# EAGLE design AstroEQ PTH MK2 (EAGLE 6.4)
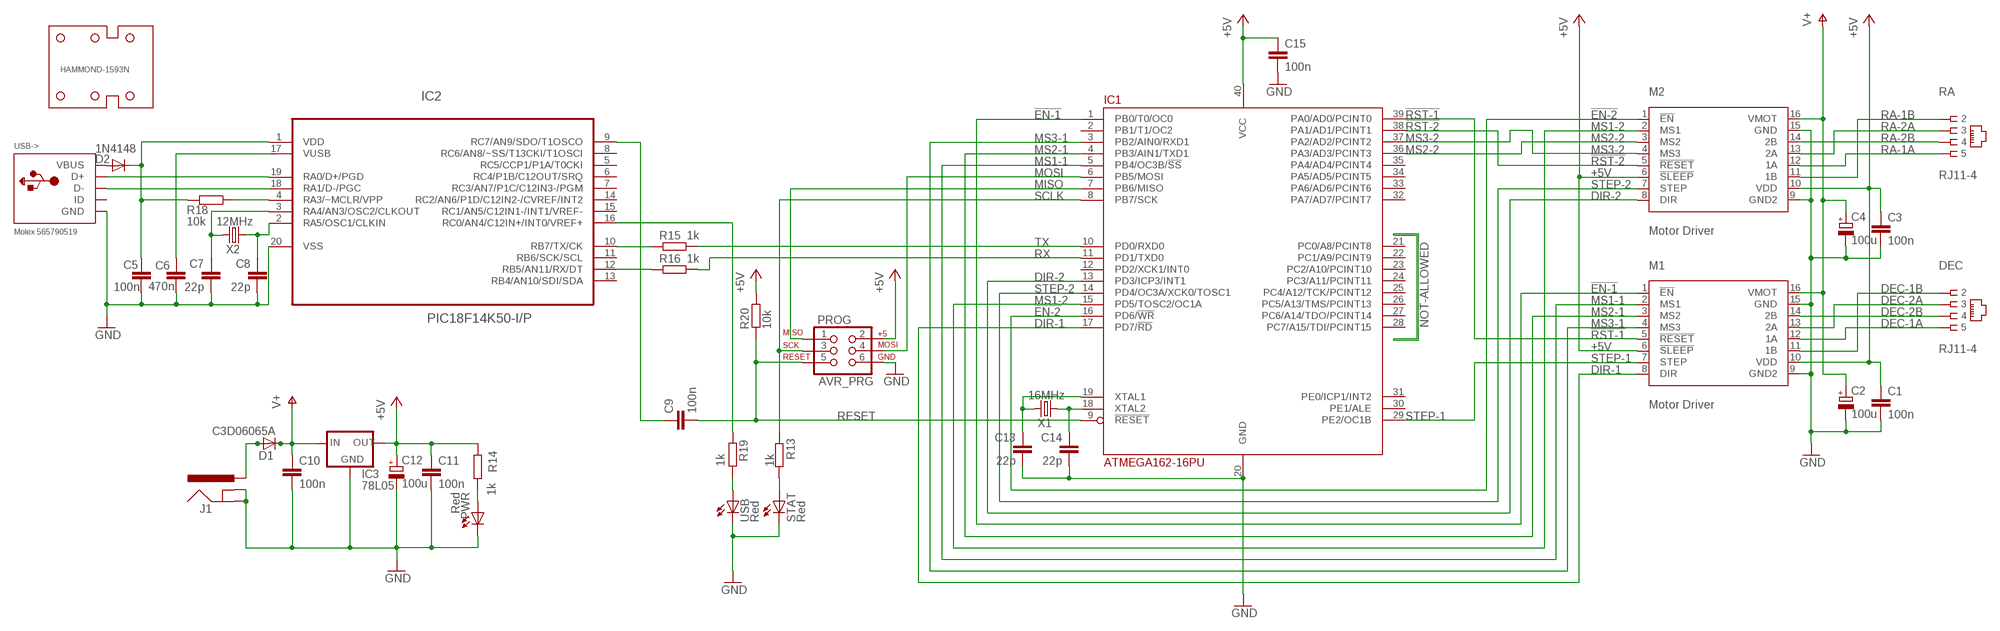
[diagram p0: schematic, sheet 1]

## Parts
C1  100n  C-EU025-024X044  [C025-024X044]
C2  100u  CPOL-EUE2.5-7  [E2,5-7]
C3  100n  C-EU025-024X044  [C025-024X044]
C4  100u  CPOL-EUE2.5-7  [E2,5-7]
C5  100n  C-EU025-024X044  [C025-024X044]
C6  470n  C-EU025-024X044  [C025-024X044]
C7  22p  C-EU025-024X044  [C025-024X044]
C8  22p  C-EU025-024X044  [C025-024X044]
C9  100n  C-EU025-024X044  [C025-024X044]
C10  100n  C-EU025-024X044  [C025-024X044]
C11  100n  C-EU025-024X044  [C025-024X044]
C12  100u  CPOL-EUE2.5-7  [E2,5-7]
C13  22p  C-EU025-024X044  [C025-024X044]
C14  22p  C-EU025-024X044  [C025-024X044]
C15  100n  C-EU025-024X044  [C025-024X044]
D1  C3D06065A  MUR820  [C221B1A]
D2  1N4148  DIODE1N4148  [DIODE-1N4148]
DEC  RJ11-4  [RJ11-NO_SHIELD-4]
HAMMOND-1593N  HAMMOND-1593N  [HAMMOND-1593N]
IC1  ATMEGA162-16PU  [DIL40]
IC2  PIC18F14K50-I/P  [DIL20]
IC3  78L05  V_REG_78XXTO-92  [TO-92]
J1  POWER_JACKPTH  [POWER_JACK_PTH]
M1  Motor Driver  A4983CARRIER  [DIP16-W]
M2  Motor Driver  A4983CARRIER  [DIP16-W]
PROG  AVR_PRG  AVR_SPI_PRG_6PTH  [2X3]
PWR  Red  LED3MM  [LED3MM]
R13  1k  R-EU_0204/7  [0204/7]
R14  1k  R-EU_0204/7  [0204/7]
R15  1k  R-EU_0204/7  [0204/7]
R16  1k  R-EU_0204/7  [0204/7]
R18  10k  R-EU_0204/7  [0204/7]
R19  1k  R-EU_0204/7  [0204/7]
R20  10k  R-EU_0204/7  [0204/7]
RA  RJ11-4  [RJ11-NO_SHIELD-4]
STAT  Red  LED3MM  [LED3MM]
USB  Red  LED3MM  [LED3MM]
USB->  Molex 565790519  USBMOLEX  [USB-MINIB-THM-MOLEX]
X1  16MHz  CRYSTALHC49US  [HC49US]
X2  12MHz  CRYSTALHC49US  [HC49US]

## Nets
!EN-1: IC1.1(PB0/T0/OC0) M1.1(!EN)
!EN-2: IC1.16(PD6/!WR) M2.1(!EN)
!RST-1: IC1.39(PA0/AD0/PCINT0) M1.5(!RESET)
!RST-2: IC1.38(PA1/AD1/PCINT1) M2.5(!RESET)
+5V: C1.1 C3.1 C11.1 C12.+ C15.1 IC1.40(VCC) IC3.1(OUT) M1.6(!SLEEP) M1.10(VDD) M2.6(!SLEEP) M2.10(VDD) PROG.2 R14.1 R20.2
AVROSC1: C13.1 IC1.19(XTAL1) X1.2
AVROSC2: C14.1 IC1.18(XTAL2) X1.1
D+: IC2.19(RA0/D+/PGD) USB->.D+
D-: IC2.18(RA1/D-/PGC) USB->.D-
DEC-1A: DEC.5 M1.12(1A)
DEC-1B: DEC.2 M1.11(1B)
DEC-2A: DEC.3 M1.13(2A)
DEC-2B: DEC.4 M1.14(2B)
DIR-1: IC1.17(PD7/!RD) M1.8(DIR)
DIR-2: IC1.13(PD3/ICP3/INT1) M2.8(DIR)
DTR: C9.1 IC2.9(RC7/AN9/SDO/T1OSCO)
GND: C1.2 C2.- C3.2 C4.- C5.2 C6.1 C7.2 C8.2 C10.2 C11.2 C12.- C13.2 C14.2 C15.2 IC1.20(GND) IC2.20(VSS) IC3.2(GND) J1.GND J1.GNDBREAK M1.9(GND2) M1.15(GND) M2.9(GND2) M2.15(GND) PROG.6 PWR.K(C) STAT.K(C) USB->.GND USB->.GND1(GND) USB->.GND4(GND) USB.K(C)
MCLR: IC2.4(RA3/~MCLR/VPP) R18.1
MISO: IC1.7(PB6/MISO) PROG.1
MOSI: IC1.6(PB5/MOSI) PROG.4
MS1-1: IC1.5(PB4/OC3B/!SS) M1.2(MS1)
MS1-2: IC1.15(PD5/TOSC2/OC1A) M2.2(MS1)
MS2-1: IC1.4(PB3/AIN1/TXD1) M1.3(MS2)
MS2-2: IC1.36(PA3/AD3/PCINT3) M2.3(MS2)
MS3-1: IC1.3(PB2/AIN0/RXD1) M1.4(MS3)
MS3-2: IC1.37(PA2/AD2/PCINT2) M2.4(MS3)
PWRLED: PWR.A R14.2
RA-1A: M2.12(1A) RA.5
RA-1B: M2.11(1B) RA.2
RA-2A: M2.13(2A) RA.3
RA-2B: M2.14(2B) RA.4
RESET: C9.2 IC1.9(!RESET) PROG.5 R20.1
RX: IC1.11(PD1/TXD0) R16.1
RX(USB): IC2.12(RB5/AN11/RX/DT) R16.2
SCLK: IC1.8(PB7/SCK) PROG.3 R13.1
STATLED: R13.2 STAT.A
STEP-1: IC1.29(PE2/OC1B) M1.7(STEP)
STEP-2: IC1.14(PD4/OC3A/XCK0/TOSC1) M2.7(STEP)
TX: IC1.10(PD0/RXD0) R15.1
TX(USB): IC2.10(RB7/TX/CK) R15.2
USBLED: R19.1 USB.A
USBOSC1: C8.1 IC2.2(RA5/OSC1/CLKIN) X2.1
USBOSC2: C7.1 IC2.3(RA4/AN3/OSC2/CLKOUT) X2.2
USBSTAT: IC2.16(RC0/AN4/C12IN+/INT0/VREF+) R19.2
V+: C2.+ C4.+ C10.1 D1.C IC3.3(IN) M1.16(VMOT) M2.16(VMOT)
VBUS: D2.A USB->.VBUS
VIN: D1.A J1.PWR
VPIC: C5.1 D2.C IC2.1(VDD) R18.2
VUSB: C6.2 IC2.17(VUSB)
Unconnected: IC1.2(PB1/T1/OC2) IC1.12(PD2/XCK1/INT0) IC1.21(PC0/A8/PCINT8) IC1.22(PC1/A9/PCINT9) IC1.23(PC2/A10/PCINT10) IC1.24(PC3/A11/PCINT11) IC1.25(PC4/A12/TCK/PCINT12) IC1.26(PC5/A13/TMS/PCINT13) IC1.27(PC6/A14/TDO/PCINT14) IC1.28(PC7/A15/TDI/PCINT15) IC1.30(PE1/ALE) IC1.31(PE0/ICP1/INT2) IC1.32(PA7/AD7/PCINT7) IC1.33(PA6/AD6/PCINT6) IC1.34(PA5/AD5/PCINT5) IC1.35(PA4/AD4/PCINT4) IC2.5(RC5/CCP1/P1A/T0CKI) IC2.6(RC4/P1B/C12OUT/SRQ) IC2.7(RC3/AN7/P1C/C12IN3-/PGM) IC2.8(RC6/AN8/~SS/T13CKI/T1OSCI) IC2.11(RB6/SCK/SCL) IC2.13(RB4/AN10/SDI/SDA) IC2.14(RC2/AN6/P1D/C12IN2-/CVREF/INT2) IC2.15(RC1/AN5/C12IN1-/INT1/VREF-) USB->.ID

## Library data of the parts
C1 C3 C5 C9-C11 C15 = resistor:C-EU: CAPACITOR, European symbol; MF: AVX; MPN: SR205C104KAR; OC_FARNELL: 1100367
C2 C4 C12 = resistor:CPOL-EU: POLARIZED CAPACITOR, European symbol; MF: MULTICOMP; MPN: MCGPR25V107M6.3X11; OC_FARNELL: 9451188
C6 = rcl:C-EU: CAPACITOR, European symbol; MF: KEMET; MPN: C320C474M5U5TA; OC_FARNELL: 1457660
C7 C8 C13 C14 = rcl:C-EU: CAPACITOR, European symbol; MF: AVX; MPN: SR151A220JAR; OC_FARNELL: 1100369
D1 = diode:MUR820: DIODE; MF: CREE; MPN: C3D06065A; OC_FARNELL: 1864928
D2 = SparkFun:DIODE: Diode These are standard reverse protection diodes and small signal diodes. SMA package can handle up to about 1A. SOD-323 can handle about 200mA. What the SOD-323 package when ordering, there are some mfgs out there that are 5-pin packages.; MF: MULTICOMP; MPN: 1N4148.; OC_FARNELL: 9565124
DEC RA = con-tycoelectronics:RJ11-4; MF: MOLEX; MPN: 95501-2641; OC_FARNELL: 1560166
HAMMOND-1593N = holes:HAMMOND-1593N; MF: HAMMOND; MPN: 1593NBK; OC_FARNELL: 9287566
IC1 = atmel:ATMEGA162: 8-bit RISC MICROCONTROLLER 16K Bytes internal flash program memory 1K Bytes internal SRAM Upto 64K Bytes optional external memory space 512 Bytes EEPROM Two 8-bit timers Two 16-bit timers Dual programmable serial USARTs Master/Slave serial SPI interface Source: ATMEGA162_DIP40.lbr; MF: ATMEL; MPN: ATMEGA162-16PU; OC_FARNELL: 9171169
IC2 = microchip:PIC18F14K50-I/P: USB Flash Microcontrollers; MF: MICROCHIP; MPN: PIC18F14K50-I/P; OC_FARNELL: 1648501; OC_NEWARK: 77M3103; PACKAGE: DIP-20; SUPPLIER: Microchip
IC3 = SparkFun:V_REG_78XX: Voltage Regulator Standard 7805 5V regulator. IGO (Input Ground Output). Spark Fun Electronics SKU : COM-00107; MF: FAIRCHILD SEMICONDUCTOR; MPN: LM78L05ACZX; OC_FARNELL: 1467367
J1 = SparkFun:POWER_JACK: Power Jack This is the standard 5.5mm barrel jack for power. The PTH is the most common, proven, reliable, footprint. All others are experimental. The Slot footprint only works if the mill layer is transmitted to the PCB fab house so be warned. Spark Fun Electronics SKU : PRT-00119. Mating wall wart : TOL-00298 (and others); MF: MULTICOMP; MPN: MJ-179PH; OC_FARNELL: 1737246
M1 M2 = A4983Carrier:A4983CARRIER; MF: SAMTEC; MPN: CES-116-01-T-S; OC_FARNELL: 1667522
PROG = SparkFun:AVR_SPI_PRG_6: AVR ISP 6 Pin This is the reduced ISP connector for AVR programming. Common on Arduino. This footprint will take up less PCB space and can be used with a 10-pin to 6-pin adapter such as SKU: BOB-08508; MF: TE CONNECTIVITY / AMP; MPN: 826632-3; OC_FARNELL: 3418492
PWR STAT USB = led:LED: LED OSRAM: - CHIPLED LG R971, LG N971, LY N971, LG Q971, LY Q971, LO R971, LY R971 LH N974, LH R974 LS Q976, LO Q976, LY Q976 LO Q996 - Hyper CHIPLED LW Q18S LB Q993, LB Q99A, LB R99A - SideLED LS A670, LO A670, LY A670, LG A670, LP A670 LB A673, LV A673, LT A673, LW A673 LH A674 LY A675 LS A676, LA A676, LO A676, LY A676, LW A676 LS A679, LY A679, LG A679 - Hyper Micro SIDELED® LS Y876, LA Y876, LO Y876, LY Y876 LT Y87S - SmartLED LW L88C, LW L88S LB L89C, LB L89S, LG L890 LS L89K, LO L89K, LY L89K LS L896, LA L896, LO L896, LY L896 - TOPLED LS T670, LO T670, LY T670, LG T670, LP T670 LSG T670, LSP T670, LSY T670, LOP T670, LYG T670 LG T671, LOG T671, LSG T671 LB T673, LV T673, LT T673, LW T673 LH T674 LS T676, LA T676, LO T676, LY T676, LB T676, LH T676, LSB T676, LW T676 LB T67C, LV T67C, LT T67C, LS T67K, LO T67K, LY T67K, LW E67C LS E67B, LA E67B, LO E67B, LY E67B, LB E67C, LV E67C, LT E67C LW T67C LS T679, LY T679, LG T679 LS T770, LO T770, LY T770, LG T770, LP T770 LB T773, LV T773, LT T773, LW T773 LH T774 LS E675, LA E675, LY E675, LS T675 LS T776, LA T776, LO T776, LY T776, LB T776 LHGB T686 LT T68C, LB T68C - Hyper Mini TOPLED® LB M676 - Mini TOPLED Santana® LG M470 LS M47K, LO M47K, LY M47K Source: http://www.osram.convergy.de LUXEON: - LUMILED® LXK2-PW12-R00, LXK2-PW12-S00, LXK2-PW14-U00, LXK2-PW14-V00 LXK2-PM12-R00, LXK2-PM12-S00, LXK2-PM14-U00 LXK2-PE12-Q00, LXK2-PE12-R00, LXK2-PE12-S00, LXK2-PE14-T00, LXK2-PE14-U00 LXK2-PB12-K00, LXK2-PB12-L00, LXK2-PB12-M00, LXK2-PB14-N00, LXK2-PB14-P00, LXK2-PB14-Q00 LXK2-PR12-L00, LXK2-PR12-M00, LXK2-PR14-Q00, LXK2-PR14-R00 LXK2-PD12-Q00, LXK2-PD12-R00, LXK2-PD12-S00 LXK2-PH12-R00, LXK2-PH12-S00 LXK2-PL12-P00, LXK2-PL12-Q00, LXK2-PL12-R00 Source: www.luxeon.com KINGBRIGHT: KA-3528ASYC Source: www.kingbright.com; MF: KINGBRIGHT; MPN: L-424HDT; OC_FARNELL: 1142499
R13 R14 R19 = rcl:R-EU_: RESISTOR, European symbol; MF: MULTICOMP; MPN: MF12 1K; OC_FARNELL: 9342400
R15 R16 = SmartPrj:R-EU_: RESISTOR, European symbol; MF: MULTICOMP; MPN: MF12 1K; OC_FARNELL: 9342400
R18 R20 = rcl:R-EU_: RESISTOR, European symbol; MF: MULTICOMP; MPN: MF12 10K; OC_FARNELL: 9342419
USB-> = adafruit:USB: USB Connectors USBMINIB - Surface Mount Female Mini-B USB Connector 4UConnector: 06564 By microbuilder.eu Thru-hole RA Female Mini-B USB Connector 4UConnector: 18732 By ladyada.net; MF: MOLEX; MPN: 565790519; OC_FARNELL: 1125347
X1 = SparkFun:CRYSTAL: Crystals Various standard crystals. Proven footprints. Spark Fun Electronics SKU : COM-00534; MF: TXC; MPN: 9B-16.000MEEJ-B; OC_FARNELL: 1842217
X2 = SparkFun:CRYSTAL: Crystals Various standard crystals. Proven footprints. Spark Fun Electronics SKU : COM-00534; MF: TXC; MPN: 9B-12.000MAAJ-B; OC_FARNELL: 1842203

## Net classes
1 power: width 0.61 mm, drill 0.711 mm, clearance 0.203 mm
2 gnd: width 0.305 mm, drill 0.711 mm, clearance 0.203 mm
3 usbvcc: width 0.508 mm, drill 0.711 mm, clearance 0.203 mm

## Board
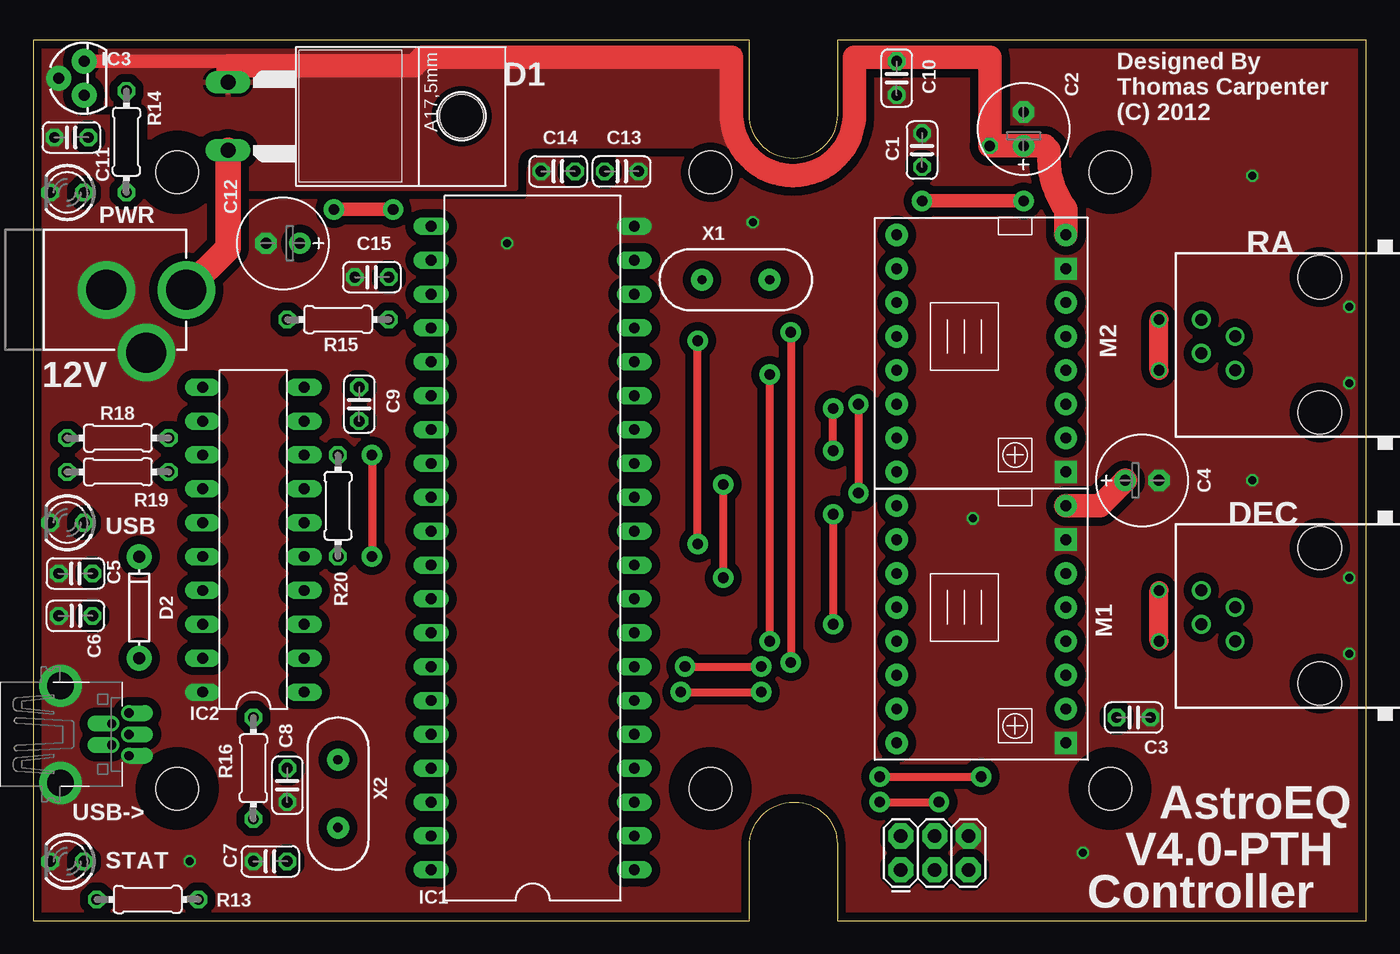
[diagram p1: board, top side]
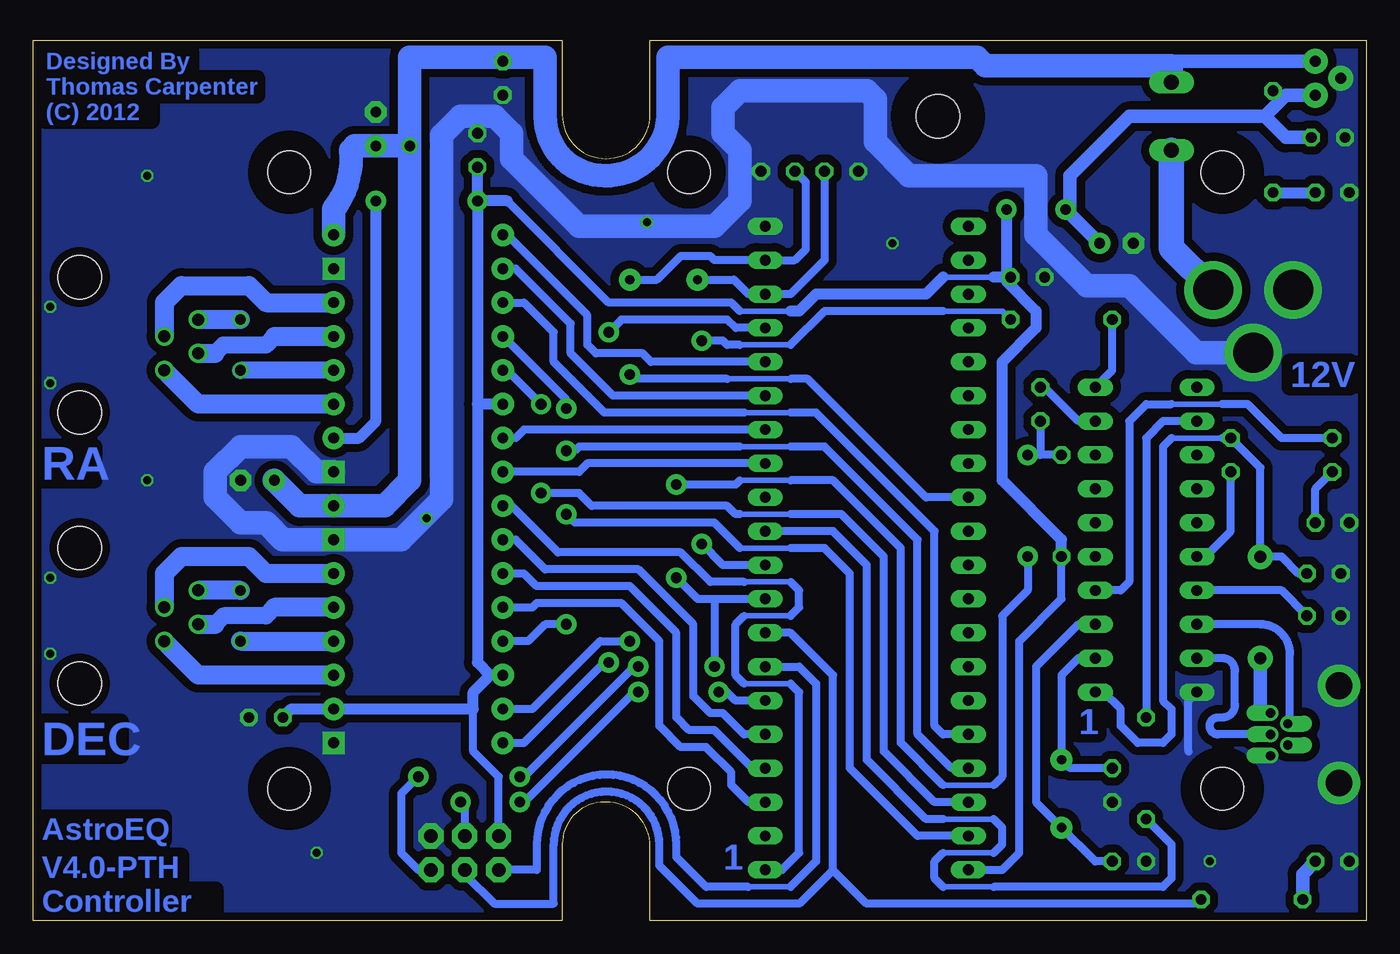
[diagram p2: board, bottom side, seen from below]

Size 100 x 66.04 mm. Coordinates in mm from the lower left corner, seen from the top.
Outline: 57.02,8.89 57.15,8.89
Copper layers (1*16): Top 0.035mm / dielectric 1.5mm / Bottom 0.035mm
Design rules "default": minimum track width 6mil, minimum drill 12mil, track to track 6mil, track to pad 6mil, pad to pad 6mil, via to via 6mil, smd to smd 0mil, copper to edge 10mil, drill to drill 10mil, minimum pad ring 10mil, minimum via ring 6mil, stop-mask expansion 2mil, vias tented up to drill 0.8mm, thermal gap 10mil
tKeepout: area 78.3,7.4 to 83.3,12.4; area 78.3,53.6 to 83.3,58.6; area 48.3,7.4 to 53.3,12.4; area 8.3,7.4 to 13.3,12.4; area 48.3,53.6 to 53.3,58.6; area 8.3,53.6 to 13.3,58.6
bKeepout: area 78.3,7.4 to 83.3,12.4; area 78.3,53.6 to 83.3,58.6; area 48.3,7.4 to 53.3,12.4; area 8.3,7.4 to 13.3,12.4; area 48.3,53.6 to 53.3,58.6; area 8.3,53.6 to 13.3,58.6
tRestrict: area 78.3,53.6 to 83.3,58.6; area 78.3,7.4 to 83.3,12.4; area 48.3,7.4 to 53.3,12.4; area 8.3,7.4 to 13.3,12.4; area 8.3,53.6 to 13.3,58.6; area 6.3,56.2 to 7.9,60.6
bRestrict: area 78.3,53.6 to 83.3,58.6; area 78.3,7.4 to 83.3,12.4; area 8.3,7.4 to 13.3,12.4; area 8.3,53.6 to 13.3,58.6; 2 lines

### Footprints (pad centres in the part's own frame; a part is rotated, then mirrored left to right if it is on the bottom)
C025-024X044 = drill 0.813 octagon: 1 -1.27,0; 2 1.27,0
E2,5-7 = drill 0.813 pad 1.6: + -1.27,0 | drill 0.813 pad 1.6 octagon: - 1.27,0
C221B1A = drill 1.118 long: A 2.54,-6.35; C -2.54,-6.35 | hole 3.302: 0,11.176
DIODE-1N4148 = drill 0.9 pad 1.88: A -3.81,0; C 3.81,0
RJ11-NO_SHIELD-4 = drill 0.9 pad 1.4: 2 -1.905,6.35; 3 -0.635,8.89; 4 0.635,6.35; 5 1.905,8.89 | hole 3.251: -5.08,0; 5.08,0
HAMMOND-1593N = hole 3.2: 10.795,9.906; 10.795,56.134; 50.8,9.906; 50.8,56.134; 80.797,9.906; 80.797,56.134
DIL40 = drill 0.813 long: 1 -24.13,-7.62; 2 -21.59,-7.62; 3 -19.05,-7.62; 4 -16.51,-7.62; 5 -13.97,-7.62; 6 -11.43,-7.62; 7 -8.89,-7.62; 8 -6.35,-7.62; 9 -3.81,-7.62; 10 -1.27,-7.62; 11 1.27,-7.62; 12 3.81,-7.62; 13 6.35,-7.62; 14 8.89,-7.62; 15 11.43,-7.62; 16 13.97,-7.62; 17 16.51,-7.62; 18 19.05,-7.62; 19 21.59,-7.62; 20 24.13,-7.62; 21 24.13,7.62; 22 21.59,7.62; 23 19.05,7.62; 24 16.51,7.62; 25 13.97,7.62; 26 11.43,7.62; 27 8.89,7.62; 28 6.35,7.62; 29 3.81,7.62; 30 1.27,7.62; 31 -1.27,7.62; 32 -3.81,7.62; 33 -6.35,7.62; 34 -8.89,7.62; 35 -11.43,7.62; 36 -13.97,7.62; 37 -16.51,7.62; 38 -19.05,7.62; 39 -21.59,7.62; 40 -24.13,7.62
DIL20 = drill 0.813 long: 1 -3.81,11.43; 2 -3.81,8.89; 3 -3.81,6.35; 4 -3.81,3.81; 5 -3.81,1.27; 6 -3.81,-1.27; 7 -3.81,-3.81; 8 -3.81,-6.35; 9 -3.81,-8.89; 10 -3.81,-11.43; 11 3.81,-11.43; 12 3.81,-8.89; 13 3.81,-6.35; 14 3.81,-3.81; 15 3.81,-1.27; 16 3.81,1.27; 17 3.81,3.81; 18 3.81,6.35; 19 3.81,8.89; 20 3.81,11.43
TO-92 = drill 0.813 pad 1.88: 1 -1.27,0; 2 0,1.905; 3 1.27,0
POWER_JACK_PTH = drill 2.997 pad 4.318: GND 0,7.7; GNDBREAK 4.7,10.7; PWR 0,13.7
DIP16-W = drill 0.813 pad 1.676: 1 -8.89,-6.35; 2 -6.35,-6.35; 3 -3.81,-6.35; 4 -1.27,-6.35; 5 1.27,-6.35; 6 3.81,-6.35; 7 6.35,-6.35; 8 8.89,-6.35; 10 6.35,6.35; 11 3.81,6.35; 12 1.27,6.35; 13 -1.27,6.35; 14 -3.81,6.35; 16 -8.89,6.35 | drill 0.813 pad 1.676 square: 9 8.89,6.35; 15 -6.35,6.35
2X3 = drill 1.016 pad 1.88 octagon: 1 0,0; 2 0,2.54; 3 2.54,0; 4 2.54,2.54; 5 5.08,0; 6 5.08,2.54
LED3MM = drill 0.813 octagon: A -1.27,0; K 1.27,0
0204/7 = drill 0.813 octagon: 1 -3.81,0; 2 3.81,0
USB-MINIB-THM-MOLEX = drill 0.7 offset: D+ 0,9.72; D- -0.8,8.42; GND 1.6,9.72; ID 0.8,8.42; VBUS -1.6,9.72 | drill 2 pad 3.175: GND1 -3.65,4.57; GND4 3.65,4.57
HC49US = drill 0.7 pad 1.651: 1 -2.54,0; 2 2.54,0

### Placement (x,y rotation side)
C1  66.67,57.78 90 top
C2  74.3,59.37 90 top
C3  82.55,15.24 0 top
C4  83.19,33.02 0 top
C5  3.17,26.04 180 top
C6  3.17,22.86 0 top
C7  17.78,4.45 180 top
C8  19.05,10.16 270 top
C9  24.45,38.73 270 top
C10  64.77,63.18 270 top
C11  2.86,58.74 180 top
C12  18.73,50.8 180 top
C13  44.13,56.2 0 top
C14  39.37,56.2 180 top
C15  25.4,48.26 180 top
D1  20.95,60.33 270 top
D2  7.94,23.5 90 top
DEC  96.52,22.86 90 top
HAMMOND-1593N  0,0 0 top
IC1  37.47,27.94 90 top
IC2  16.51,28.57 180 top
IC3  3.81,63.18 90 top
J1  -2.22,47.31 270 top
M1  71.12,22.23 270 top
M2  71.12,42.55 270 top
PROG  65.09,3.81 0 top
PWR  2.54,54.61 180 top
R13  8.57,1.59 180 top
R14  6.99,58.42 270 top
R15  22.86,45.09 180 top
R16  16.51,11.43 90 top
R18  6.35,36.2 0 top
R19  6.35,33.66 0 top
R20  22.86,31.11 270 top
RA  96.52,43.18 90 top
STAT  2.54,4.45 180 top
USB  2.54,29.84 180 top
USB->  -2.54,13.97 270 top
X1  52.7,48.07 0 top
X2  22.86,9.53 270 top

### Tracks (layer width: path | path; a pad name or v marks a point on that pad's centre or on a via)
!EN-1
  Bottom 0.406: 43.18,17.78 46.67,17.78 | 46.67,22.86 43.18,22.86 | 43.18,25.4 46.67,25.4
  Bottom 0.61: IC1.1 43.81,3.81 42.55,5.08 42.55,17.14 43.18,17.78 | 46.67,17.78 47.31,18.41 47.31,22.23 46.67,22.86 | 43.18,22.86 42.55,23.5 42.55,24.77 43.18,25.4 | 46.67,25.4 49.21,25.4 51.44,27.62 60.64,27.62 64.14,31.11 M1.1
!EN-2
  Bottom 0.61: IC1.16 53.66,41.91 54.29,42.55 57.78,42.55 58.42,43.18 58.42,45.4 64.45,51.44 M2.1
!RST-1  (via drill 0.8 pad 1.52)
  Top 0.61: v60.01,30.48 v60.01,22.23
  Bottom 0.406: 43.18,27.94 46.99,27.94
  Bottom 0.61: IC1.39 33.66,6.35 38.73,11.43 38.73,26.04 40.64,27.94 43.18,27.94 | 46.99,27.94 48.9,29.84 59.37,29.84 v60.01,30.48 | v60.01,22.23 61.59,22.23 62.87,20.95 M1.5
!RST-2  (via drill 0.8 pad 1.52)
  Top 0.61: v61.91,38.73 v61.91,32.07
  Bottom 0.406: 43.18,30.48 46.99,30.48
  Bottom 0.61: M2.5 64.45,41.27 v61.91,38.73 | IC1.38 32.38,8.89 36.2,12.7 36.2,27.3 39.37,30.48 43.18,30.48 | 46.99,30.48 47.31,30.48 47.94,31.11 58.1,31.11 59.05,32.07 v61.91,32.07
+5V  (via drill 0.8 pad 1.52)
  Top 1.016: v66.67,53.98 v74.3,53.98 | v22.54,53.34 v26.99,53.34
  Bottom 0.406: 27.94,48.26 31.75,48.26 | 43.18,45.72 46.99,45.72
  Bottom 0.61: IC1.40 27.3,3.81 26.04,5.08 26.04,20.95 22.86,24.13 R20.2 | 46.99,45.72 47.62,46.35 56.83,46.35 64.45,53.98 | PROG.2 65.09,10.79 66.99,12.7 66.99,15.88
  Bottom 0.813: C3.1 80.64,15.88 M1.10 66.99,15.88 66.99,17.14 65.72,18.41 | M2.10 75.56,36.2 74.3,37.47 v74.3,53.98 | M1.6 65.72,18.41 | v66.67,53.98 C1.1 | R20.2 22.86,28.57 27.3,33.02 27.3,41.91 24.77,44.45 24.77,45.72 26.99,47.94 26.99,48.26 | C15.1 26.99,48.26 | 26.99,48.26 27.94,48.26 | 31.75,48.26 33.02,46.99 41.27,46.99 42.55,45.72 43.18,45.72 | 64.45,53.98 v66.67,53.98 | 22.23,53.66 22.23,53.34 v22.54,53.34 | v26.99,53.34 26.99,48.26 | M2.6 66.67,38.73 | v66.67,53.98 66.67,38.73 | 66.67,38.73 66.67,19.37 65.72,18.41
  Bottom 1.016: IC3.1 6.03,61.91 6.35,61.59 | 6.35,61.59 7.62,60.33 | 7.62,60.33 17.78,60.33 22.23,55.88 22.23,53.66 22.23,53.02 C12.+ | R14.1 6.35,61.59 | C11.1 6.03,58.74 7.62,60.33
AVROSC1
  Bottom 0.61: C13.1 42.07,55.4 42.07,50.32 42.86,49.53 IC1.19 48.9,49.53 49.21,49.85 51.44,49.85 53.02,48.26 53.21,48.07 X1.2
AVROSC2
  Bottom 0.61: C14.1 40.64,49.53 43.18,46.99 IC1.18 46.35,46.99 47.31,47.94 47.43,48.07 X1.1
D+
  Bottom 0.61: USB->.D+ 11.11,13.97 arc90 11.75,14.61 arc90 11.11,15.24 10.79,15.24 arc-90 9.84,16.19 9.84,18.73 arc-90 10.79,19.68 IC2.19
D-
  Bottom 0.61: USB->.D- 5.71,14.77 5.71,20 arc-90 7.94,22.23 IC2.18
DEC-1A  (via drill 0.8)
  Top 1.422: v84.45,20.95 v84.45,24.77
  Bottom 1.422: v84.45,24.77 DEC.5 | v84.45,20.95 M1.12
DEC-1B
  Bottom 1.422: M1.11 87.63,18.41 DEC.2
DEC-2A
  Bottom 1.27: 81.92,23.5 82.55,22.86 85.72,22.86 86.36,22.23
  Bottom 1.422: DEC.3 86.36,22.23 | M1.13 81.92,23.5
DEC-2B
  Bottom 1.422: M1.14 82.55,26.04 83.82,27.3 88.9,27.3 90.17,26.04 DEC.4
DIR-1  (via drill 0.8 pad 1.52)
  Top 0.61: v56.83,44.13 v56.83,19.37
  Bottom 0.61: IC1.17 47.31,44.45 47.94,45.09 55.88,45.09 v56.83,44.13 | M1.8 63.18,13.34 57.15,19.37 v56.83,19.37
DIR-2
  Bottom 0.61: IC1.13 58.42,34.29 59.05,33.66 M2.8
DTR
  Bottom 0.61: C9.1 24.13,40.01 21.59,37.47 IC2.9
GND  (via drill 0.6)
  Bottom 0.61: 13.34,12.7 13.34,16.51 IC2.20
  Bottom 1.778: J1.GNDBREAK 12.76,42.61 17.78,47.62 20.95,47.62 24.77,51.44 24.77,55.88 34.29,55.88 36.83,58.42 36.83,61.59 37.47,62.23 46.99,62.23 48.26,60.96 48.26,59.05 46.99,57.78 46.99,53.98 48.9,52.07 59.05,52.07 64.14,57.15 64.14,59.05 65.41,60.33 67.94,60.33 69.37,58.9 69.37,31.59 72.39,28.57 M1.15 81.28,28.57 82.55,29.84 84.45,29.84 86.36,31.75 86.36,33.66 84.45,35.56 80.64,35.56 78.74,33.66 M2.9
  other vias: 35.56,50.8 78.74,5.08 98.74,25.72 98.74,20 98.74,46.04 98.74,40.32 91.44,55.88 91.44,33.02 70.48,30.16 53.98,52.39 11.75,4.45
  pour Top (isolate 0.61, rank 2, no thermals): -1.27,66.99 101.03,66.99 101.03,-0.95 -1.27,-0.95
  pour Bottom (isolate 0.61, no thermals): -1.27,66.99 101.03,66.99 101.03,-0.95 -1.27,-0.95
MCLR
  Bottom 0.406: 10.79,38.73 14.61,38.73
  Bottom 0.61: R18.1 6.35,36.2 8.89,38.73 10.79,38.73 | IC2.4 18.41,24.77 17.78,25.4 17.78,37.47 16.51,38.73 14.61,38.73
MISO
  Bottom 0.406: 43.18,2.54 46.35,2.54
  Bottom 0.61: IC1.7 42.55,19.05 41.27,17.78 41.27,4.45 43.18,2.54 | 46.35,2.54 49.53,2.54 51.75,4.76 51.75,5.71 arc-180 62.23,5.71 62.23,3.81 PROG.1
MOSI  (via drill 0.8 pad 1.52)
  Top 0.61: v48.58,17.14 v54.61,17.14 | v63.5,8.89 v67.94,8.89
  Bottom 0.61: IC1.6 47.31,16.51 47.94,17.14 v48.58,17.14 | v54.61,17.14 54.93,17.14 63.18,8.89 v63.5,8.89 | v67.94,8.89 67.63,8.57 PROG.4
MS1-1
  Bottom 0.61: IC1.5 46.67,13.97 48.26,15.56 49.21,15.56 50.48,16.83 50.48,22.23 54.61,26.35 61.59,26.35 63.82,28.57 M1.2
MS1-2
  Bottom 0.61: IC1.15 56.52,39.37 59.69,42.55 59.69,44.77 63.82,48.9 M2.2
MS2-1
  Bottom 0.61: IC1.4 46.04,11.43 48.9,14.29 50.8,14.29 51.75,15.24 51.75,21.59 55.24,25.08 62.23,25.08 63.18,26.04 M1.3
MS2-2
  Bottom 0.406: 43.18,38.1 46.67,38.1
  Bottom 0.61: M2.3 63.18,46.35 60.96,44.13 60.96,41.91 57.15,38.1 46.67,38.1 | IC1.36 31.75,13.97 32.38,14.61 32.38,29.21 41.27,38.1 43.18,38.1
MS3-1
  Bottom 0.61: IC1.3 46.35,8.89 47.62,10.16 47.62,11.11 49.53,13.02 51.44,13.02 53.02,14.61 53.02,20.95 55.88,23.81 62.23,23.81 62.55,23.5 M1.4
MS3-2  (via drill 0.8 pad 1.52)
  Top 0.61: v60.01,35.24 v60.01,38.42
  Bottom 0.406: 43.18,35.56 46.99,35.56
  Bottom 0.61: IC1.37 31.11,11.43 33.66,13.97 33.66,28.57 40.64,35.56 43.18,35.56 | 46.99,35.56 59.05,35.56 59.37,35.24 v60.01,35.24 | v60.01,38.42 60.01,39.05 M2.4
PWRLED
  Bottom 0.813: R14.2 PWR.A
RA-1A  (via drill 0.8)
  Top 1.422: v84.45,41.27 v84.45,45.09
  Bottom 1.27: M2.12 v84.45,41.27
  Bottom 1.422: v84.45,45.09 RA.5
RA-1B
  Bottom 1.422: M2.11 87.63,38.73 RA.2
RA-2A
  Bottom 1.27: 86.36,42.55 85.72,43.18 82.55,43.18 81.92,43.81
  Bottom 1.422: RA.3 86.36,42.55 | 81.92,43.81 M2.13
RA-2B
  Bottom 1.422: M2.14 82.55,46.35 83.82,47.62 88.9,47.62 90.17,46.35 RA.4
RESET  (via drill 0.8 pad 1.52)
  Top 0.61: v25.4,34.92 v25.4,27.3 | v51.75,32.7 v51.75,25.72 | v48.9,19.05 v54.61,19.05 | v63.5,10.79 v71.12,10.79
  Bottom 0.406: 27.94,10.16 31.75,10.16 | 43.18,33.02 46.99,33.02
  Bottom 0.61: R20.1 24.45,34.92 | C9.2 24.45,34.92 | 24.45,34.92 v25.4,34.92 | v25.4,27.3 25.4,24.77 27.3,22.86 27.3,10.79 27.94,10.16 | 31.75,10.16 34.92,13.34 34.92,27.94 40.01,33.02 43.18,33.02 | 46.99,33.02 47.31,32.7 v51.75,32.7 | v51.75,25.72 50.16,24.13 48.9,24.13 | 48.9,24.13 IC1.9 | 48.9,24.13 v48.9,19.05 | v54.61,19.05 54.93,19.05 63.18,10.79 v63.5,10.79 | v71.12,10.79 72.39,9.53 72.39,5.08 71.12,3.81 PROG.5
RX
  Bottom 0.406: 27.94,2.54 31.75,2.54 | 31.75,5.08 27.94,5.08 | 27.94,7.62 31.75,7.62
  Bottom 0.61: R16.1 14.61,5.71 14.61,3.17 15.24,2.54 27.94,2.54 | 31.75,2.54 32.38,3.17 32.38,4.45 31.75,5.08 | 27.94,5.08 27.3,5.71 27.3,6.99 27.94,7.62 | 31.75,7.62 33.02,7.62 37.47,12.06 37.47,26.67 40.01,29.21 IC1.11
RX(USB)
  Bottom 0.61: IC2.12 15.24,37.47 16.51,36.2 R16.2
SCLK
  Bottom 0.61: R13.1 12.7,1.27 37.49,1.27 40.01,3.79 | 40.01,3.79 40.01,18.41 43.18,21.59 IC1.8 | 40.01,3.79 42.52,1.27 50.16,1.27 53.02,4.13 53.02,5.71 arc-180 60.96,5.71 60.96,1.27 65.41,1.27 67.63,3.49 PROG.3
STATLED
  Bottom 1.016: STAT.A 4.76,3.49 R13.2
STEP-1  (via drill 0.8 pad 1.52)
  Top 0.61: v55.24,40.96 v55.24,20.95
  Bottom 0.406: 43.18,40.64 47.94,40.64
  Bottom 0.61: IC1.29 33.02,31.75 41.91,40.64 43.18,40.64 | 47.94,40.64 54.93,40.64 v55.24,40.96 | M1.7 62.55,15.88 57.47,20.95 v55.24,20.95
STEP-2
  Bottom 0.61: IC1.14 63.18,36.83 63.82,36.2 M2.7
TX  (via drill 0.8 pad 1.52)
  Top 0.61: v49.85,28.26 v49.85,43.5
  Bottom 0.406: R15.1 27.3,45.72 31.75,45.72 | 43.18,43.18 46.99,43.18
  Bottom 0.61: 31.75,45.72 40.64,45.72 43.18,43.18 | 46.99,43.18 47.94,43.18 48.26,43.5 v49.85,43.5 | IC1.10 48.26,26.67 v49.85,28.26
TX(USB)
  Bottom 0.61: IC2.10 19.05,41.27 R15.2
USBLED
  Bottom 0.61: USB.A 3.81,32.38 R19.1
USBOSC1
  Bottom 0.61: IC2.2 21.59,19.68 22.86,18.41 X2.1 22.23,11.43 C8.1
USBOSC2
  Bottom 0.61: IC2.3 21.59,22.23 24.77,19.05 24.77,8.89 X2.2 20.32,4.45 C7.1
USBSTAT
  Bottom 0.61: IC2.16 12.06,27.3 10.16,29.21 R19.2
V+  (via drill 0.8)
  Top 1.016: IC3.3 14.61,64.45 14.61,63.82
  Top 1.778: 14.61,63.82 D1.C 14.61,64.14 28.57,64.14 29.21,64.77 52.39,64.77 52.39,60.64 arc184 61.59,60.64 61.59,64.77 71.75,64.77 v71.75,58.1 C2.+ 75.88,58.1 76.2,57.78 76.2,57.15 arc37 77.47,53.34 M2.16 | M1.16 80.01,31.11 C4.+
  Bottom 0.61: C10.1 64.77,64.77 | D1.C 14.61,63.5 14.61,64.45 14.29,64.45
  Bottom 1.016: IC3.3 14.29,64.45
  Bottom 1.778: C4.+ 80.01,31.11 M1.16 73.66,31.11 71.75,33.02 v71.75,58.1 | v71.75,58.1 71.75,64.77 64.77,64.77 61.59,64.77 61.59,60.33 arc-90 57.15,55.88 arc-90 52.39,60.33 52.39,64.77 29.21,64.77 28.57,64.14 14.61,64.14 14.61,63.5 | M2.16 77.47,53.34 arc-45 76.2,57.78 75.88,58.1 C2.+ v71.75,58.1
  pour Top (isolate 0.61): 3.17,66.04 3.17,61.28 6.99,61.28 6.99,54.93 36.2,54.93 36.2,56.83 arc-90 37.47,58.1 50.8,58.1 50.8,57.47 57.15,57.47 57.15,66.04
VBUS
  Bottom 1.016: USB->.VBUS 7.94,15.57 D2.A
VIN
  Top 1.93: J1.PWR 14.61,50.44 D1.A
  Bottom 1.93: J1.PWR 14.61,50.44 D1.A
VPIC
  Bottom 0.406: 10.79,36.2 14.61,36.2
  Bottom 0.61: 10.79,36.2 R18.2 7.94,33.97 D2.C 6.35,27.3 5.08,26.04 C5.1 | 14.61,36.2 15.24,35.56 15.24,16.51 14.61,15.88 14.61,13.97 15.24,13.34 17.14,13.34 18.41,14.61 18.41,15.88 19.68,17.14 IC2.1
VUSB
  Bottom 0.61: C6.2 6.35,24.77 IC2.17

### Text on the board
Bottom: Designed By | Thomas Carpenter | (C) 2012 | 12V | RA | 1 | DEC | AstroEQ | 1 | V4.0-PTH | Controller
tNames: Designed By | Thomas Carpenter | (C) 2012 | 12V | AstroEQ | V4.0-PTH | Controller
tValues: 8824/5 | Sq Pad | 4988 | 8824/5 | Sq Pad | 4988 | Markings show the location of the Potentiometers on the | Pololu Boards depending on which chip they use.
tDocu: This board design is for DIY/Kit AstroEQ boards | It is a 2 Layer board designed to be sent for manufacture. The AstroEQ-PTH-Gerber.zip file contains the required gerber files. | I use iteadstudio.com 10cm x 10cm prototype service, selecting 1.2mm thick, HASL, 100% electrical check